# EAGLE design WifiArduino (EAGLE 7.1.0)
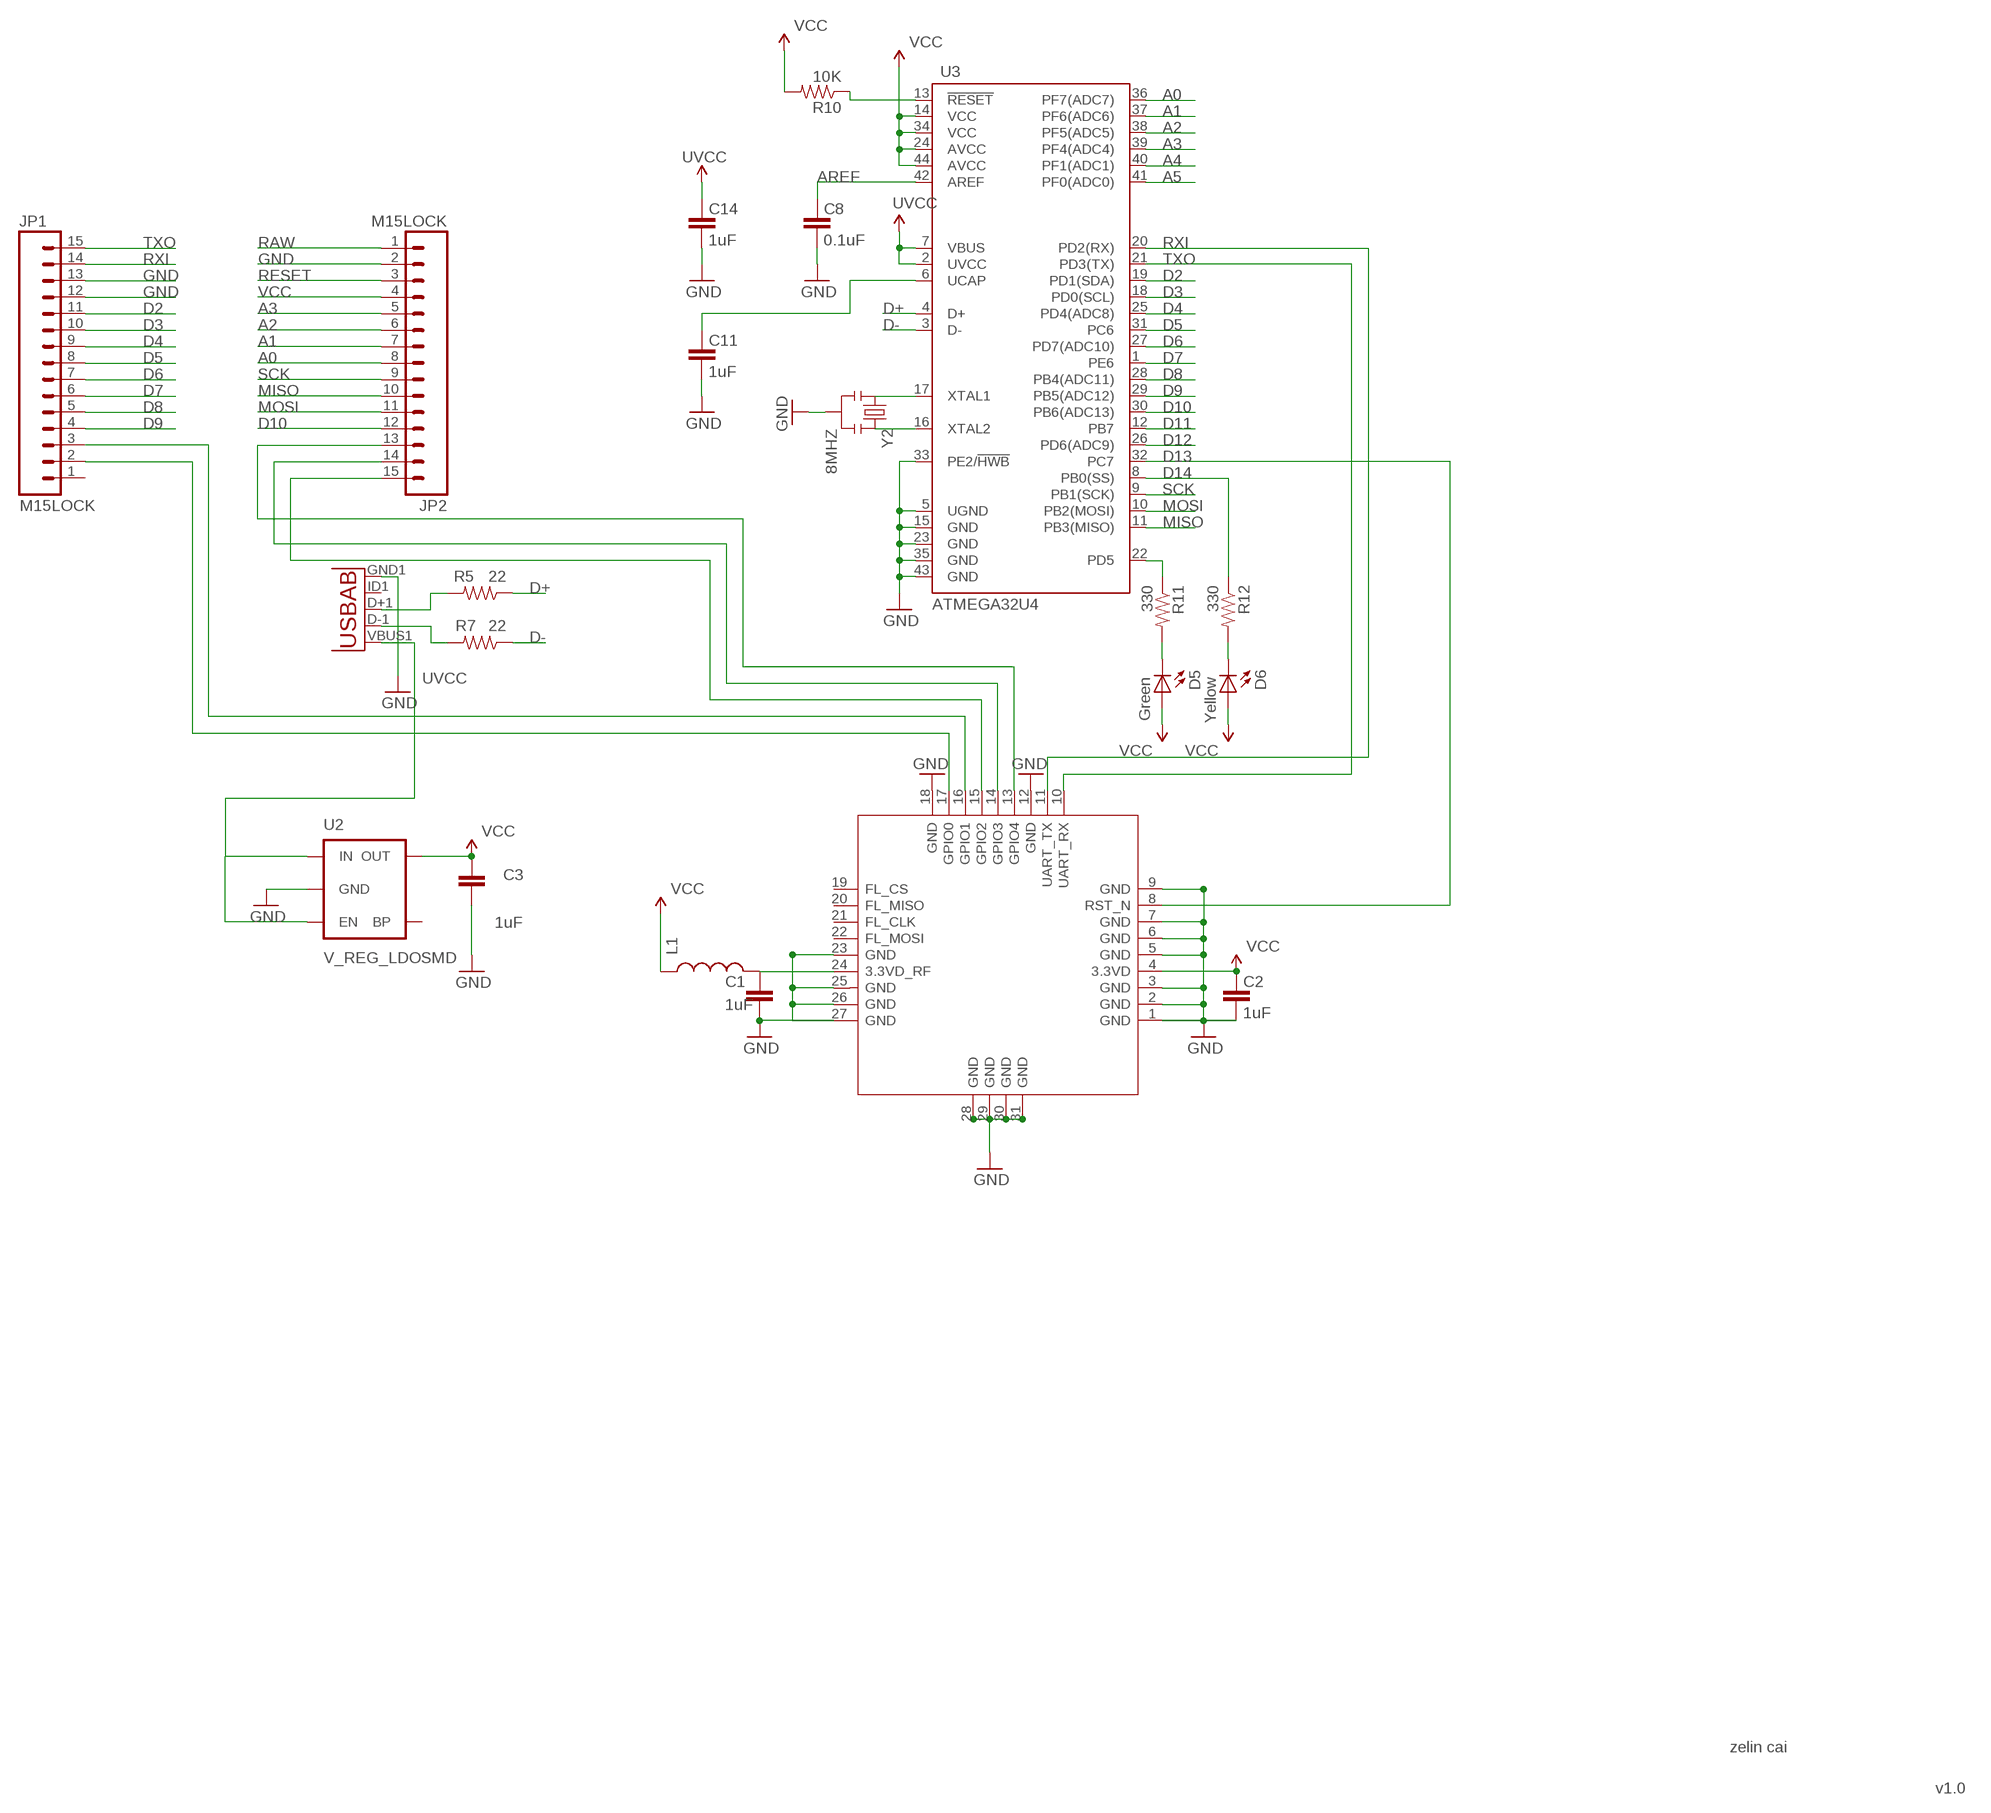
[diagram p0: schematic, sheet 1]

## Parts
C1  1uF  CAP0805  [0805]
C2  1uF  CAP0805  [0805]
C3  1uF  CAP0805  [0805]
C8  0.1uF  CAP0603-CAP  [0603-CAP]
C11  1uF  CAP0603-CAP  [0603-CAP]
C14  1uF  CAP0603-CAP  [0603-CAP]
D5  Green  LED0603  [LED-0603]
D6  Yellow  LED0603  [LED-0603]
JP1  M15LOCK  [1X15_LOCK]
JP2  M15LOCK  [1X15_LOCK]
L1  INDUCTOR0805  [0805]
R5  22  RESISTOR0603-RES  [0603-RES]
R7  22  RESISTOR0603-RES  [0603-RES]
R10  10K  RESISTOR0603-RES  [0603-RES]
R11  330  RESISTOR0603-RES  [0603-RES]
R12  330  RESISTOR0603-RES  [0603-RES]
U1  MT7681_MOD  MT7681  [31P-L18.0XW15.0MM]
U2  V_REG_LDOSMD  [SOT23-5]
U3  ATMEGA32U4  ATMEGA32U4OUTFAKES  [QFN-44-NOPAD_1:1-OUTFAKES]
X1  USB-ABIN&OUT  [USB-AB-MICRO-SMD-V03-IN&OUT]
Y2  8MHZ  RESONATOR8MHZ  [RESONATOR-SMD]

## Nets
3.3V: C2.2 C3.2 D5.A D6.A L1.1 R10.2 U1.4(3.3VD) U2.5(OUT) ; supply symbol labelled VCC
A0: JP2.8 U3.36(PF7(ADC7))
A1: JP2.7 U3.37(PF6(ADC6))
A2: JP2.6 U3.38(PF5(ADC5))
A3: JP2.5 U3.39(PF4(ADC4))
A4: U3.40(PF1(ADC1))
A5: U3.41(PF0(ADC0))
AREF: C8.2 U3.42(AREF)
D2: JP1.11 U3.19(PD1(SDA))
D3: JP1.10 U3.18(PD0(SCL))
D4: JP1.9 U3.25(PD4(ADC8))
D5: JP1.8 U3.31(PC6)
D6: JP1.7 U3.27(PD7(ADC10))
D7: JP1.6 U3.1(PE6)
D8: JP1.5 U3.28(PB4(ADC11))
D9: JP1.4 U3.29(PB5(ADC12))
D10: JP2.12 U3.30(PB6(ADC13))
D11: U3.12(PB7)
D12: U3.26(PD6(ADC9))
D13: U1.8(RST_N) U3.32(PC7)
D14: R12.1 U3.8(PB0(SS))
D+: R5.1 U3.4(D+)
D-: R7.1 U3.3(D-)
GND: C1.1 C2.1 C3.1 C8.1 C11.1 C14.1 JP1.12 JP1.13 JP2.2 U1.1(GND) U1.2(GND) U1.3(GND) U1.5(GND) U1.6(GND) U1.7(GND) U1.9(GND) U1.12(GND) U1.18(GND) U1.23(GND) U1.25(GND) U1.26(GND) U1.27(GND) U1.28(GND) U1.29(GND) U1.30(GND) U1.31(GND) U2.2(GND) U3.5(UGND) U3.15(GND) U3.23(GND) U3.33(PE2/!HWB) U3.35(GND) U3.43(GND) X1.GND1(GND) Y2.2
MISO: JP2.10 U3.11(PB3(MISO))
MOSI: JP2.11 U3.10(PB2(MOSI))
N$1: U3.16(XTAL2) Y2.3
N$2: U3.17(XTAL1) Y2.1
N$3: C1.2 L1.2 U1.24(3.3VD_RF)
N$4: JP2.13 U1.13(GPIO4)
N$5: JP2.14 U1.14(GPIO3)
N$6: R7.2 X1.D-1(D-)
N$7: JP2.15 U1.15(GPIO2)
N$8: R5.2 X1.D+1(D+)
N$9: JP1.3 U1.16(GPIO1)
N$10: JP1.2 U1.17(GPIO0)
N$11: R10.1 U3.13(!RESET)
N$12: C11.2 U3.6(UCAP)
N$15: D6.C R12.2
N$16: D5.C R11.2
RAW [vcc]: JP2.1
RESET: JP2.3
RXI: JP1.14 U1.11(UART_TX) U3.20(PD2(RX))
SCK: JP2.9 U3.9(PB1(SCK))
TXLED: R11.1 U3.22(PD5)
TXO: JP1.15 U1.10(UART_RX) U3.21(PD3(TX))
UVCC: C14.2 U2.1(IN) U2.3(EN) U3.2(UVCC) U3.7(VBUS) X1.VBUS1(VBUS)
VCC: JP2.4 U3.14(VCC) U3.24(AVCC) U3.34(VCC) U3.44(AVCC)
Unconnected: JP1.1 U1.19(FL_CS) U1.20(FL_MISO) U1.21(FL_CLK) U1.22(FL_MOSI) U2.4(BP) X1.ID1(USBID)

## Notes on the sheet
- zelin cai
- v1.0

## Library data of the parts
C1-C3 C8 C11 C14 = SparkFun:CAP: Capacitor Standard 0603 ceramic capacitor, and 0.1" leaded capacitor.
D5 D6 = SparkFun:LED: LEDs Standard schematic elements and footprints for 5mm, 3mm, 1206, and 0603 sized LEDs. 5mm - Spark Fun Electronics SKU : COM-00529 (and others)
JP1 JP2 = SparkFun-Connectors:M15: Header 15 Standard 15-pin 0.1" header. Use with straight break away headers (SKU : PRT-00116), right angle break away headers (PRT-00553), swiss pins (PRT-00743), machine pins (PRT-00117), and female headers (PRT-00115).
L1 = SparkFun-Passives:INDUCTOR: Inductors Basic Inductor/Choke - 0603 and 1206. Footprints are not proven and vary greatly between part numbers. SRN6045- 33uH, 20% 1.4A SDR0403-560KL - 56uH, 10%, 500mA RMS/740mA peak
R5 R7 R10-R12 = SparkFun:RESISTOR: Resistor Basic schematic elements and footprints for 0603, 1206, and PTH resistors.
U1 = template:MT7681
U2 = SparkFun-PowerIC:V_REG_LDO: Voltage Regulator LDO Standard 150mA LDO voltage regulator in SOT-23 layout. Micrel part MIC5205. BP (by-pass) pin is used to lower output noise with 470pF cap.
U3 = Testing:ATMEGA32U4: Atmel 44-pin 8-bit Microcontroller with 32KBytes of ISP Flash and USB Controller
X1 = Testing:USB-AB: This is a USB AB connector that is compatible with USB OTG. i.e. this connector can serve as a host or device
Y2 = SparkFun-FreqCtrl:RESONATOR: Resonator Small SMD resonator. Used, eg, on the Arduino Pro/ Pro Mini boards. 8MHz- XTAL-08895 16MHz- XTAL-08900; PROD_ID: XTAL-08895

## Net classes
0 default: width 0.203 mm

## Board
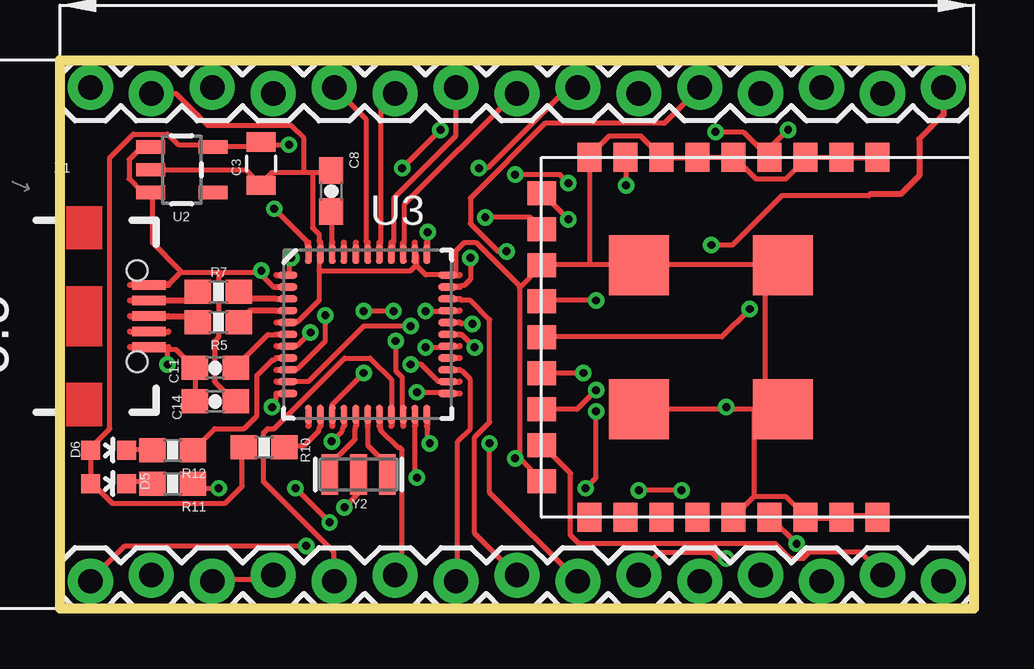
[diagram p1: board, top side]
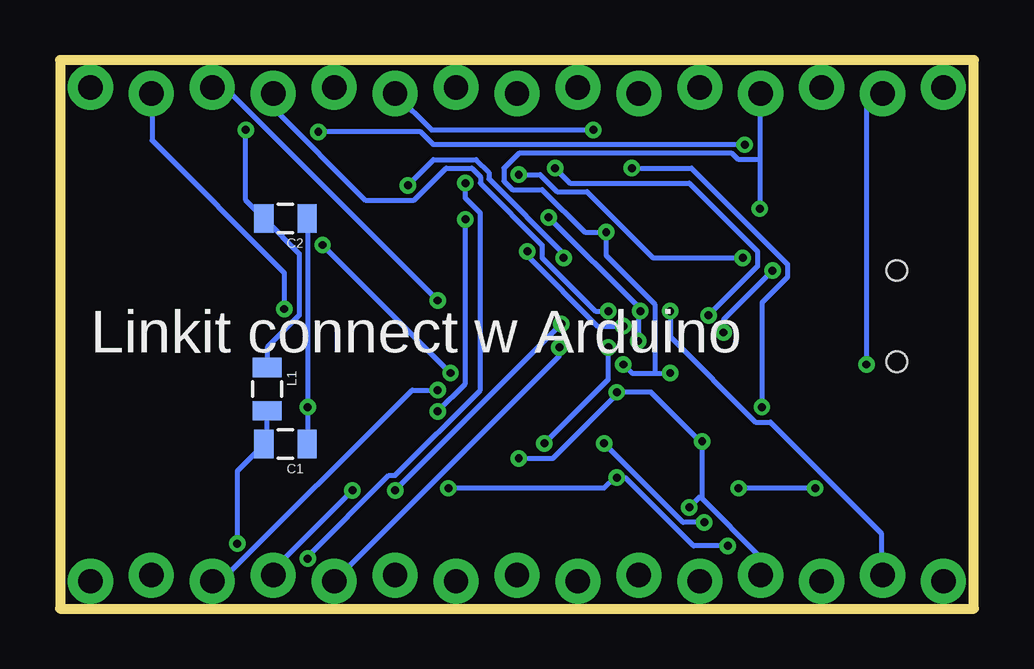
[diagram p2: board, bottom side, seen from below]

Size 38.1 x 22.86 mm. Coordinates in mm from the lower left corner, seen from the top.
Outline: 0,22.86 38.1,22.86 38.1,0 0,0 0,22.86
Copper layers (1*16): Top 0.0356mm / dielectric 1.5011mm / Bottom 0.0356mm
Design rules "LaenPCBOrder *": minimum track width 6mil, minimum drill 13mil, track to track 6mil, track to pad 6mil, pad to pad 6mil, via to via 6mil, smd to smd 6mil, copper to edge 15mil, drill to drill 6mil, minimum pad ring 7mil, minimum via ring 7mil, stop-mask expansion 3mil, vias tented up to drill 15mil, thermal gap 10mil

### Footprints (pad centres in the part's own frame; a part is rotated, then mirrored left to right if it is on the bottom)
0805 = smd 0.8 x 1.2: 1 -0.9,0; 2 0.9,0
0603-CAP = smd 1.1 x 1: 1 -0.85,0; 2 0.85,0
LED-0603 = smd 0.8 x 0.8: A 0,-0.75; C 0,0.75
1X15_LOCK = drill 1.016 pad 1.88: 1 0,0.127; 2 2.54,-0.127; 3 5.08,0.127; 4 7.62,-0.127; 5 10.16,0.127; 6 12.7,-0.127; 7 15.24,0.127; 8 17.78,-0.127; 9 20.32,0.127; 10 22.86,-0.127; 11 25.4,0.127; 12 27.94,-0.127; 13 30.48,0.127; 14 33.02,-0.127; 15 35.56,0.127
0603-RES = smd 1.1 x 1: 1 -0.85,0; 2 0.85,0
31P-L18.0XW15.0MM = smd 1.2 x 1: 1 7.5,-5; 2 7.5,-3.5; 3 7.5,-2; 4 7.5,-0.5; 5 7.5,1; 6 7.5,2.5; 7 7.5,4; 8 7.5,5.5; 9 7.5,7; 19 -7.5,7; 20 -7.5,5.5; 21 -7.5,4; 22 -7.5,2.5; 23 -7.5,1; 24 -7.5,-0.5; 25 -7.5,-2; 26 -7.5,-3.5; 27 -7.5,-5 | smd 1 x 1.2: 10 6,9; 11 4.5,9; 12 3,9; 13 1.5,9; 14 0,9; 15 -1.5,9; 16 -3,9; 17 -4.5,9; 18 -6,9 | smd 2.5 x 2.5: 28 -3,4.95; 29 3,4.95; 30 -3,-1.05; 31 3,-1.05
SOT23-5 = smd 0.55 x 1.2: 1 -0.95,-1.3; 2 0,-1.3; 3 0.95,-1.3; 4 0.95,1.3; 5 -0.95,1.3
QFN-44-NOPAD_1:1-OUTFAKES = smd 0.8 x 0.3: 1 -3.337,2.465; 2 -3.337,1.972; 3 -3.337,1.479; 4 -3.337,0.986; 5 -3.337,0.493; 6 -3.337,0; 7 -3.337,-0.493; 8 -3.337,-0.986; 9 -3.337,-1.479; 10 -3.337,-1.972; 11 -3.337,-2.465; 23 3.337,-2.465; 24 3.337,-1.972; 25 3.337,-1.479; 26 3.337,-0.986; 27 3.337,-0.493; 28 3.337,0; 29 3.337,0.493; 30 3.337,0.986; 31 3.337,1.479; 32 3.337,1.972; 33 3.337,2.465 | smd 0.3 x 0.8: 12 -2.465,-3.337; 13 -1.972,-3.337; 14 -1.479,-3.337; 15 -0.986,-3.337; 16 -0.493,-3.337; 17 0,-3.337; 18 0.493,-3.337; 19 0.986,-3.337; 20 1.479,-3.337; 21 1.972,-3.337; 22 2.465,-3.337; 34 2.465,3.337; 35 1.972,3.337; 36 1.479,3.337; 37 0.986,3.337; 38 0.493,3.337; 39 0,3.337; 40 -0.493,3.337; 41 -0.986,3.337; 42 -1.479,3.337; 43 -1.972,3.337; 44 -2.465,3.337
USB-AB-MICRO-SMD-V03-IN&OUT = smd 1.4 x 0.4: D+1 2.7,0; D-1 2.7,0.65; GND1 2.7,-1.3; ID1 2.7,-0.65; VBUS1 2.7,1.3 | hole 0.85: 2.2,1.9; 2.2,-1.9
RESONATOR-SMD = smd 0.7 x 1.7: 1 -1.2,0; 2 0,0; 3 1.2,0

### Placement (x,y rotation side)
C1  28.7,6.86 180 bottom
C2  28.7,16.26 180 bottom
C3  8.38,18.54 90 top
C8  11.3,17.4 270 top
C11  6.48,10.03 0 top
C14  6.48,8.64 0 top
D5  2.03,5.21 270 top
D6  2.03,6.6 270 top
JP1  36.83,1.27 180 top
JP2  1.27,21.59 0 top
L1  29.46,9.14 270 bottom
R5  6.6,11.94 180 top
R7  6.6,13.21 180 top
R10  8.51,6.73 180 top
R11  4.7,5.21 180 top
R12  4.7,6.6 180 top
U1  29.08,11.3 90 top
U2  5.08,18.29 270 top
U3  12.83,11.43 0 top
X1  1.02,12.19 0 top
Y2  12.45,5.59 180 top

### Tracks (layer width: path | path; a pad name or v marks a point on that pad's centre or on a via)
3.3V  (via drill 0.33)
  Top 0.203: v30.35,19.95 29.64,19.24 29.64,18.88 U1.4 29.55,19.24 29.11,19.24 28.49,19.86 v27.33,19.86 | R10.2 7.59,6.71 7.59,5.11 6.88,4.39 2.17,4.39 1.37,5.19 D5.A 1.28,5.28 1.28,6.53 D6.A 1.28,6.71 2.08,7.51 2.08,18.8 3.06,19.77 4.48,19.77 4.93,19.33 6.35,19.33 U2.5 6.44,19.24 8.13,19.24 8.31,19.42 C3.2 8.48,19.42 8.57,19.33 v9.55,19.33
  Bottom 0.203: L1.1 29.46,10.88 28.13,12.22 28.13,14.79 29.55,16.22 C2.2 29.64,16.31 30.35,17.02 v30.35,19.95 | v27.33,19.86 23.06,19.86 22.53,19.33 v9.55,19.33
A0
  Top 0.203: U3.36 14.35,15.33 14.35,16.84 18.97,21.46 JP2.8
A1
  Top 0.203: U3.37 13.91,15.33 13.91,17.11 16.48,19.68 16.48,21.64 JP2.7
A2
  Top 0.203: U3.38 13.37,15.33 13.37,20.93 13.91,21.46 JP2.6
A3
  Top 0.203: JP2.5 12.75,20.4 12.75,15.33 U3.39
AREF
  Top 0.203: U3.42 11.33,15.33 11.33,16.48 C8.2
D2
  Top 0.203: U3.19 13.82,8.22 13.82,9.55 12.93,10.44 11.86,10.44 8.93,7.51 8.66,7.51 8.48,7.33 8.48,5.28 11.42,2.35 11.42,1.19 JP1.11
D3
  Top 0.203: 13.32,7.6 13.37,7.51 13.37,7.42 14.08,6.71 14.17,6.71 14.26,6.62 14.26,1.73 13.99,1.46 JP1.10
D4
  Top 0.203: U3.25 16.75,9.91 17.11,9.55 17.11,7.51 16.57,6.97 16.57,1.19 JP1.9
D5
  Top 0.203: U3.31 16.75,12.84 17.11,12.84 17.91,12.04 17.91,7.77 17.29,7.15 17.29,3.15 18.97,1.46 JP1.8
D6  (via drill 0.33)
  Top 0.203: v15.24,10.88 16.04,10.88 U3.27 | v17.91,6.88 17.91,4.84 21.55,1.19 JP1.7
  Bottom 0.203: v15.24,10.88 15.24,9.55 v17.91,6.88
D7  (via drill 0.33)
  Top 0.203: v9.64,14.62 9.55,14.53 9.55,13.99 U3.1 | v18.97,18.09 20.84,18.09 v21.2,17.73 | v27.77,2.08 27.42,2.08 27.15,2.35 25.02,2.35 24.13,1.46 JP1.6
  Bottom 0.203: v9.64,14.62 13.37,14.62 16.13,17.37 17.37,17.37 18.09,18.09 v18.97,18.09 | v21.2,17.73 21.2,17.11 20.57,16.48 20.57,9.11 24.13,5.55 24.4,5.55 27.77,2.17 v27.77,2.08
D8  (via drill 0.33)
  Top 0.203: v17.29,10.88 16.75,11.42 U3.28
  Bottom 0.203: v17.29,10.88 17.29,10.53 JP1.5
D9  (via drill 0.33)
  Top 0.203: v17.2,11.86 16.75,11.86 U3.29 | v25.91,4.93 v24.13,4.93
  Bottom 0.203: v24.13,4.93 v17.2,11.86 | v25.91,4.93 29.2,1.64 29.2,1.46 JP1.4
D10  (via drill 0.33)
  Top 0.203: v15.24,12.39 16.04,12.39 U3.30
  Bottom 0.203: v15.24,12.39 15.77,12.39 18,14.62 18,15.15 20.57,17.73 20.57,18 20.93,18.35 22,18.35 23.33,17.02 25.38,17.02 29.2,20.84 29.2,21.46 JP2.12
D13  (via drill 0.33)
  Top 0.203: v17.11,14.62 17.11,13.73 16.84,13.46 16.75,13.46 U3.32 | v23.6,17.64 23.6,18.8 U1.8
  Bottom 0.203: v17.11,14.62 17.11,14.79 20.22,17.91 20.22,18.17 20.75,18.71 22.53,18.71 v23.6,17.64
D14
  Top 0.203: 9.01,10.44 8.93,10.35 8.84,10.35 8.22,9.73 8.22,8.04 7.68,7.51 6.44,7.51 R12.1
D+
  Top 0.254: 9.01,12.42 7.93,12.42 R5.1
D-
  Top 0.254: 9.01,12.91 7.75,12.91 R7.1
GND  (via drill 0.33)
  Top 0.203: U1.27 34,3.86 32.66,3.86 U1.26 32.49,3.77 31.15,3.77 U1.25 31.06,3.86 30.26,4.66 28.93,4.66 | 28.93,4.66 28.13,3.86 U1.23 | 27.77,8.31 30.09,8.31 U1.30 | 27.77,8.31 24.22,8.31 U1.28 | 28.93,4.66 28.93,8.22 U1.30 | v27.77,8.39 27.77,8.31 | v11.33,6.97 11.77,7.42 11.77,7.51 11.84,7.6 | v14.88,9.02 16.04,9.02 U3.23 | v11.86,4.22 12.39,4.75 12.39,5.55 Y2.2 | JP1.13 6.35,1.19 8.66,1.19 8.84,1.37 JP1.12 | C14.1 5.64,8.66 5.64,9.99 C11.1 5.55,10.08 4.84,10.79 4.57,10.79 4.49,10.8 | 4.49,10.8 X1.GND1 | v4.48,10.17 4.48,10.71 4.49,10.8 | 14.88,14.26 14.88,14.71 U3.35 | 14.88,14.26 15.24,13.91 16.04,13.91 U3.33 16.48,13.99 16.48,14.88 16.84,15.24 17.37,15.24 19.15,13.46 19.15,13.37 | 10.79,14.08 10.79,14.71 U3.43 10.79,15.33 10.79,15.6 10.53,15.86 10.53,18.17 | 10.79,14.08 10.79,12.84 9.91,11.95 9.55,11.95 U3.5 | 10.79,14.08 14.62,14.08 14.79,14.26 14.88,14.26 | 10.17,18.17 8.84,18.17 8.39,17.73 C3.1 8.31,17.73 7.77,18.26 3.86,18.26 U2.2 | 10.17,18.17 10.53,18.17 | 10.53,18.17 11.24,18.17 C8.1 | U1.1 34,18.8 32.66,18.8 U1.2 31.15,18.8 U1.3 31.06,18.71 30.26,17.91 29.02,17.91 28.13,18.8 U1.5 28.04,18.8 26.62,18.8 U1.6 26.53,18.8 25.11,18.8 U1.7 25.02,18.88 24.22,19.68 22.88,19.68 22.09,18.88 U1.9 22.09,18.71 22.09,14.35 | 19.15,6.26 20.04,5.37 U1.18 | 19.15,13.37 19.15,6.26 | 19.15,13.37 20.04,14.26 U1.12 20.13,14.35 22.09,14.35 | 22.09,14.35 24.13,14.35 U1.29 24.22,14.35 30.09,14.35 U1.31 29.38,14.26 29.38,8.39 U1.30 | JP2.2 4.84,21.46 6.17,20.13 9.64,20.13 10.17,19.6 10.17,18.17 | v18.97,6.26 19.15,6.26
  Bottom 0.203: C1.1 27.77,6.88 v27.77,8.39 27.77,16.22 C2.1 | 11.33,4.66 11.33,4.57 8.93,2.17 8.93,1.46 JP1.12 | 11.33,4.66 v11.33,6.97 11.42,6.97 13.46,9.02 v14.88,9.02 14.88,8.93 17.55,6.26 v18.97,6.26 | v11.86,4.22 11.42,4.66 11.33,4.66 | v4.48,10.17 4.48,20.84 3.86,21.46 JP2.2
MISO  (via drill 0.33)
  Top 0.203: v8.84,8.39 9.02,8.57 9.02,8.84 9.01,8.96 | v15.86,19.95 v14.26,18.35
  Bottom 0.203: v8.84,8.39 8.84,12.75 7.77,13.82 7.77,14.35 11.77,18.35 v14.26,18.35 | v15.86,19.95 22.62,19.95 JP2.10
MOSI  (via drill 0.33)
  Top 0.203: v14.62,11.77 12.66,11.77 10.35,9.46 9.55,9.46 U3.10 | v18.62,14.88 18.26,14.88 17.11,16.04 17.11,17.11 20.22,20.22 25.2,20.22 26.62,21.64 JP2.11
  Bottom 0.203: v14.62,11.77 15.68,11.77 18.62,14.71 v18.62,14.88
N$1
  Top 0.203: 12.33,7.6 12.31,7.51 12.31,7.06 11.33,6.08 11.33,5.64 Y2.3
N$2
  Top 0.203: 12.83,7.6 12.84,7.51 12.84,6.79 13.64,5.99 13.64,5.64 Y2.1
N$3  (via drill 0.33)
  Top 0.203: v30.71,2.71 29.64,3.77 U1.24
  Bottom 0.203: v30.71,2.71 30.71,5.73 29.64,6.79 C1.2 29.55,6.88 29.46,6.97 L1.2
N$4  (via drill 0.33)
  Top 0.203: v22.35,12.84 20.13,12.84 U1.13
  Bottom 0.203: v22.35,12.84 31.15,21.64 31.69,21.64 JP2.13
N$5  (via drill 0.33)
  Top 0.203: v28.75,12.48 27.6,11.33 20.13,11.33 U1.14
  Bottom 0.203: v28.75,12.48 28.75,13.99 34.27,19.51 34.27,21.46 JP2.14
N$6
  Top 0.254: 4.52,12.84 5.39,12.84 R7.2
N$7  (via drill 0.33)
  Top 0.203: v21.82,9.82 20.13,9.82 U1.15 | v27.15,15.15 28.04,15.15 30.09,17.2 33.73,17.2 33.78,17.27
  Top 0.254: JP2.15 36.83,20.57 35.81,19.56 35.81,18.03 35.05,17.27 33.78,17.27
  Bottom 0.203: v27.15,15.15 v21.82,9.82
N$8
  Top 0.254: 4.52,12.19 5.5,12.19 R5.2
N$9  (via drill 0.33)
  Top 0.203: v22.35,9.11 21.55,8.31 20.13,8.31 U1.16
  Bottom 0.203: v22.35,9.11 23.42,9.11 31.33,1.19 31.69,1.19 JP1.3
N$10
  Top 0.203: U1.17 20.13,6.79 21.29,5.64 21.29,3.06 21.64,2.71 29.82,2.71 30.44,2.08 30.97,2.08 31.24,2.35 33.38,2.35 34.27,1.46 JP1.2
N$11
  Top 0.203: 10.86,7.6 10.79,7.51 10.79,7.42 10.17,6.79 9.37,6.79 R10.1
N$12
  Top 0.203: 9.01,11.43 8.93,11.42 8.66,11.42 7.33,10.08 C11.2
N$15
  Top 0.203: D6.C 2.79,6.62 3.77,6.62 R12.2
N$16
  Top 0.203: D5.C 2.79,5.28 3.77,5.28 R11.2
RXI  (via drill 0.33)
  Top 0.203: v13.99,11.15 13.99,9.91 14.26,9.64 14.26,8.22 U3.20 | v17.73,16.31 19.6,16.31 20.04,15.86 U1.11 | v13.91,12.39 v12.66,12.39
  Bottom 0.203: 13.99,12.39 13.99,12.57 v17.73,16.31 | 13.99,12.39 v13.99,11.15 | v12.66,12.39 12.66,11.33 9.11,7.77 8.48,7.77 3.86,3.15 3.86,1.46 JP1.14 | v13.91,12.39 13.99,12.39
SCK  (via drill 0.33)
  Top 0.203: v11.06,12.22 11.06,11.15 9.91,9.99 9.55,9.99 U3.9 | v17.46,18.35 17.82,18.35 21.11,21.64 21.55,21.64 JP2.9
  Bottom 0.203: v11.06,12.22 9.02,14.26 9.02,14.88 11.86,17.73 16.84,17.73 v17.46,18.35
TXLED  (via drill 0.33)
  Top 0.203: v15.42,6.88 15.33,6.97 15.33,7.51 15.29,7.6 | v9.82,5.02 v11.24,3.59 | v6.62,5.02 5.73,5.02 5.55,5.19 R11.1
  Bottom 0.203: v15.42,6.88 12.13,3.59 v11.24,3.59 | v6.62,5.02 v9.82,5.02
TXO  (via drill 0.33)
  Top 0.203: v14.88,5.46 14.79,5.55 14.79,7.51 14.8,7.6 | v10.26,2.62 2.71,2.62 1.28,1.19 JP1.15 | v21.2,16.22 20.13,17.29 U1.10 | v22.35,8.22 22.35,5.46 v21.91,5.02
  Bottom 0.203: v10.26,2.62 11.68,2.62 14.53,5.46 v14.88,5.46 14.97,5.46 15.42,5.02 v21.91,5.02 | v21.2,16.22 21.2,9.37 v22.35,8.22
UVCC  (via drill 0.33)
  Top 0.203: U2.1 3.77,19.15 3.33,19.15 2.88,18.71 2.88,17.91 3.42,17.37 3.77,17.37 U2.3 3.86,17.29 3.86,15.24 5.02,14.08 5.02,13.99 | v10.44,11.51 9.91,10.97 9.55,10.97 U3.7 | 9.01,13.4 8.93,13.37 8.39,13.91 v8.39,14.08 8.31,13.99 6.79,13.99 6.75,13.95 | 6.75,13.95 6.62,13.82 6.62,11.33 6.44,11.15 6.44,9.46 7.24,8.66 C14.2 | 5.02,13.99 4.57,13.55 X1.VBUS1 | 5.02,13.99 6.71,13.99 6.75,13.95
  Bottom 0.203: v10.44,11.51 10.44,12.04 v8.39,14.08
VCC  (via drill 0.33)
  Top 0.203: v12.66,9.82 11.33,8.48 11.33,8.22 U3.14 | v14.62,10.17 15.06,10.17 15.77,9.46 16.04,9.46 U3.24 | v15.33,15.68 15.33,15.33 U3.34 | v8.93,16.66 10.26,15.33 U3.44
  Bottom 0.203: 13.28,9.82 14.26,9.82 v14.62,10.17 | 13.28,9.82 v12.66,9.82 | 13.28,9.82 13.28,12.66 15.33,14.71 v15.33,15.68 16.22,15.68 18,17.46 19.24,17.46 19.6,17.82 19.6,18.35 18.97,18.97 10.08,18.97 9.82,18.71 8.93,18.71 | 8.93,18.71 8.93,21.46 JP2.4 | 8.93,18.71 v8.93,16.66

### Text on the board
bPlace: Linkit connect w Arduino